# EAGLE design Apex_CV_Expander_MAIN_1.0 (EAGLE 9.5.2)
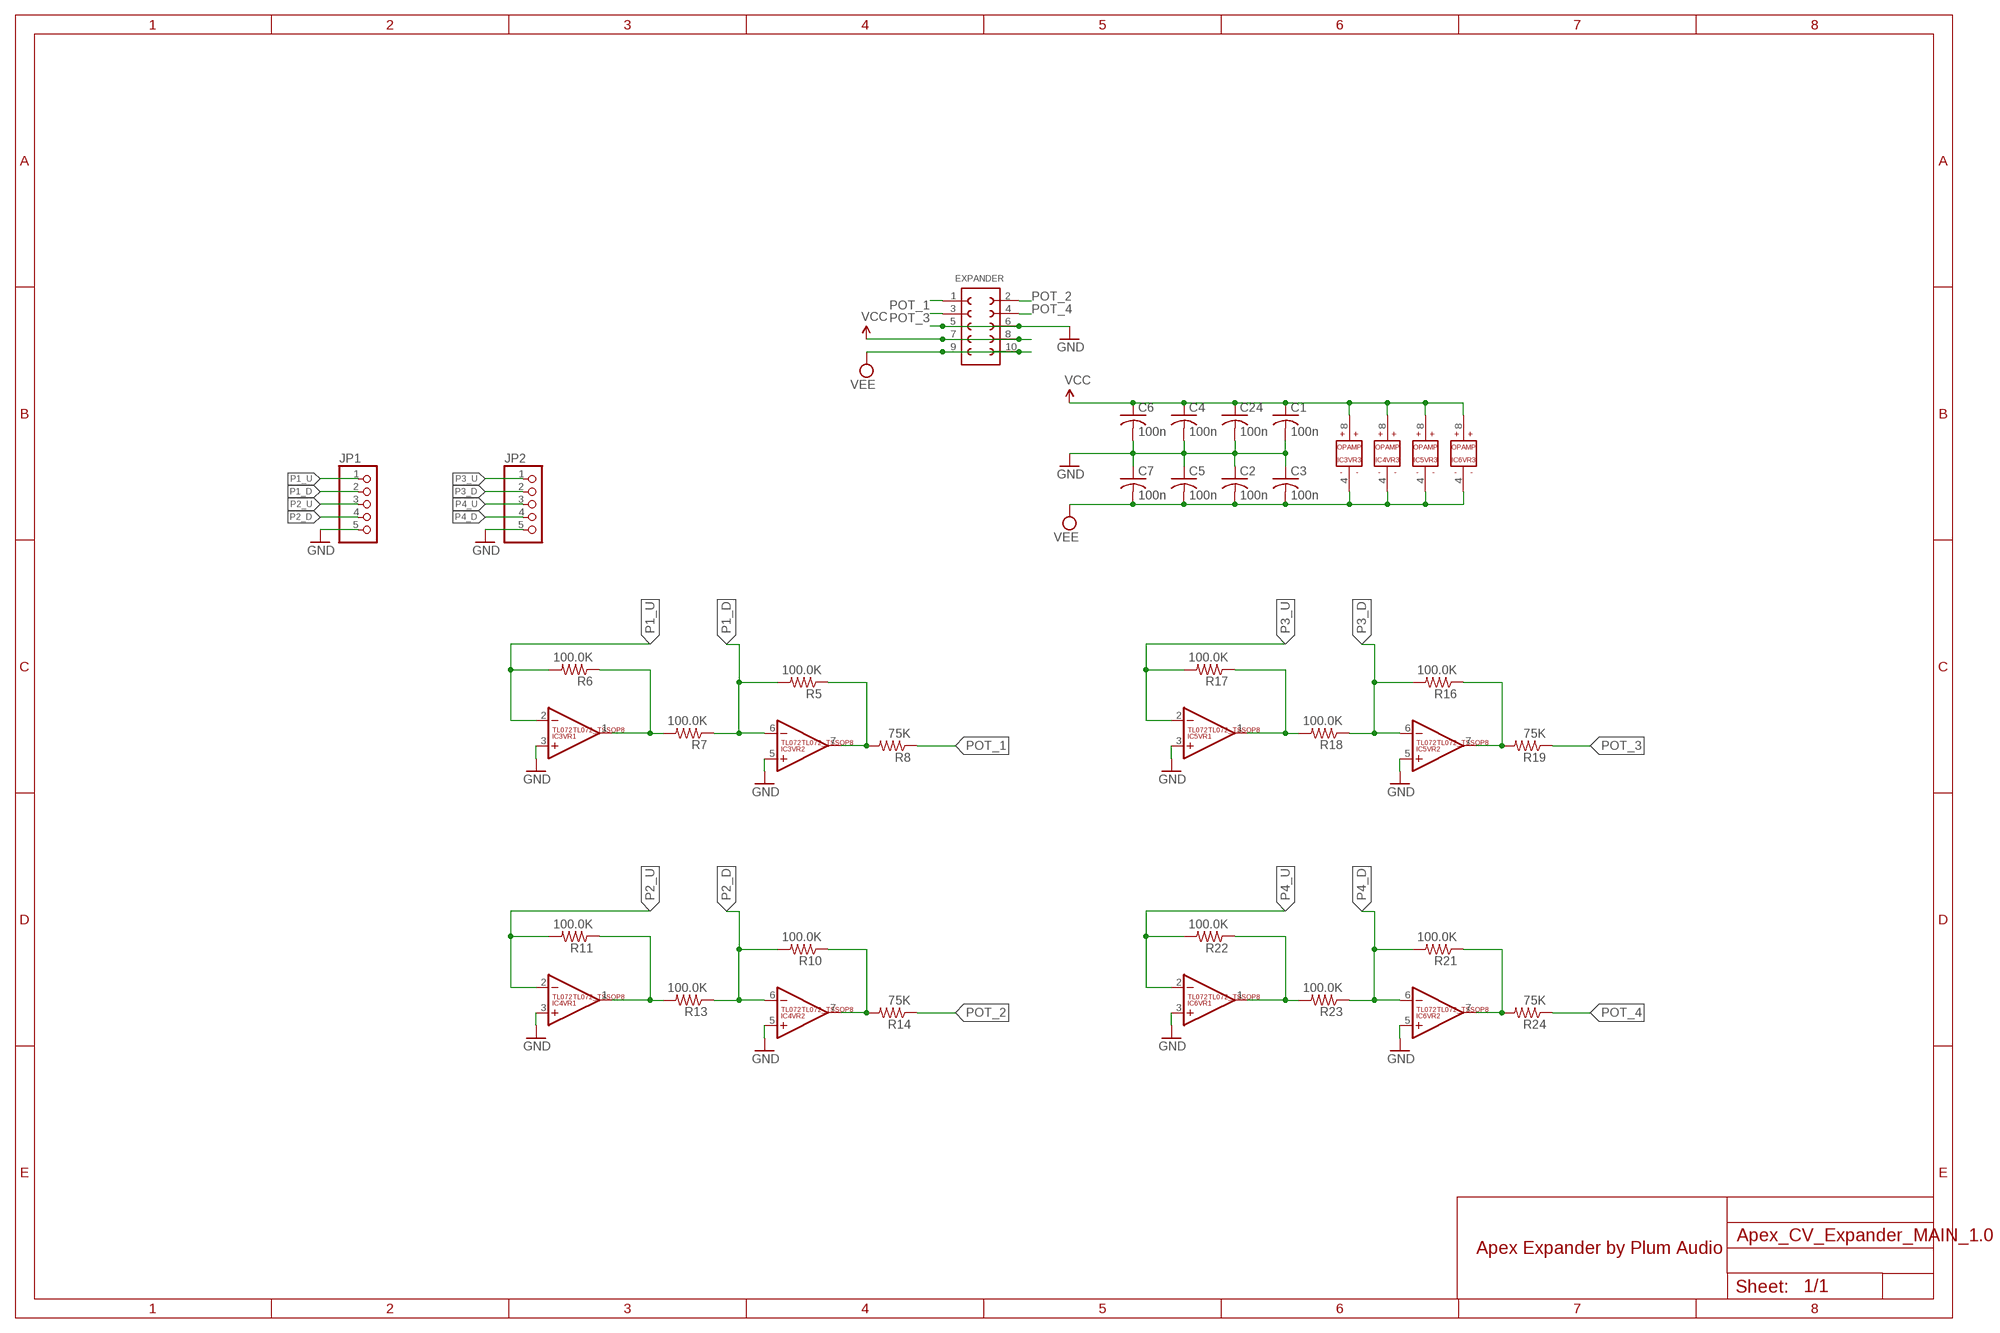
[diagram p0: schematic, sheet 1]

## Parts
C1  100n  C-USC0603  [C0603]
C2  100n  C-USC0603  [C0603]
C3  100n  C-USC0603  [C0603]
C4  100n  C-USC0603  [C0603]
C5  100n  C-USC0603  [C0603]
C6  100n  C-USC0603  [C0603]
C7  100n  C-USC0603  [C0603]
C24  100n  C-USC0603  [C0603]
EXPANDER  61301021121  [61301021121]
IC3  TL072TL072_TSSOP8  [TL072_TSSOP8]
IC4  TL072TL072_TSSOP8  [TL072_TSSOP8]
IC5  TL072TL072_TSSOP8  [TL072_TSSOP8]
IC6  TL072TL072_TSSOP8  [TL072_TSSOP8]
JP1  PINHD-1X5  [1X05]
JP2  PINHD-1X5  [1X05]
R5  100.0K  R-US_R0603  [R0603]
R6  100.0K  R-US_R0603  [R0603]
R7  100.0K  R-US_R0603  [R0603]
R8  75K  R-US_R0603  [R0603]
R10  100.0K  R-US_R0603  [R0603]
R11  100.0K  R-US_R0603  [R0603]
R13  100.0K  R-US_R0603  [R0603]
R14  75K  R-US_R0603  [R0603]
R16  100.0K  R-US_R0603  [R0603]
R17  100.0K  R-US_R0603  [R0603]
R18  100.0K  R-US_R0603  [R0603]
R19  75K  R-US_R0603  [R0603]
R21  100.0K  R-US_R0603  [R0603]
R22  100.0K  R-US_R0603  [R0603]
R23  100.0K  R-US_R0603  [R0603]
R24  75K  R-US_R0603  [R0603]

## Nets
GND: C1.2 C2.1 C3.1 C4.2 C5.1 C6.2 C7.1 C24.2 EXPANDER.5 EXPANDER.6 IC3.3(VR1:+IN) IC3.5(VR2:+IN) IC4.3(VR1:+IN) IC4.5(VR2:+IN) IC5.3(VR1:+IN) IC5.5(VR2:+IN) IC6.3(VR1:+IN) IC6.5(VR2:+IN) JP1.5 JP2.5
N$4: IC3.7(VR2:OUT) R5.1 R8.2
N$6: IC3.1(VR1:OUT) R6.1 R7.2
N$10: IC4.7(VR2:OUT) R10.1 R14.2
N$12: IC4.1(VR1:OUT) R11.1 R13.2
N$16: IC5.7(VR2:OUT) R16.1 R19.2
N$18: IC5.1(VR1:OUT) R17.1 R18.2
N$22: IC6.7(VR2:OUT) R21.1 R24.2
N$24: IC6.1(VR1:OUT) R22.1 R23.2
P1_D: IC3.6(VR2:-IN) JP1.2 R5.2 R7.1
P1_U: IC3.2(VR1:-IN) JP1.1 R6.2
P2_D: IC4.6(VR2:-IN) JP1.4 R10.2 R13.1
P2_U: IC4.2(VR1:-IN) JP1.3 R11.2
P3_D: IC5.6(VR2:-IN) JP2.2 R16.2 R18.1
P3_U: IC5.2(VR1:-IN) JP2.1 R17.2
P4_D: IC6.6(VR2:-IN) JP2.4 R21.2 R23.1
P4_U: IC6.2(VR1:-IN) JP2.3 R22.2
POT_1: EXPANDER.1 R8.1
POT_2: EXPANDER.2 R14.1
POT_3: EXPANDER.3 R19.1
POT_4: EXPANDER.4 R24.1
VCC: C1.1 C4.1 C6.1 C24.1 EXPANDER.7 EXPANDER.8 IC3.8(VR3:V+) IC4.8(VR3:V+) IC5.8(VR3:V+) IC6.8(VR3:V+)
VEE: C2.2 C3.2 C5.2 C7.2 EXPANDER.9 EXPANDER.10 IC3.4(VR3:V-) IC4.4(VR3:V-) IC5.4(VR3:V-) IC6.4(VR3:V-)

## Notes on the sheet
- Apex Expander by Plum Audio

## Library data of the parts
C1-C7 C24 = rcl:C-US: CAPACITOR, American symbol
EXPANDER = Wurth_Elektronik_Electromechanic_Board_to_Board_Connectors_rev18b:61301021121: WR-PHD 2.54mm Dual Pin Header, 10 Pins =>Code : Con_BTB_PHD_2.54_2_61301021121 <http://katalog.we-online.de/media/images/eican/Con_BTB_PHD_2.54_2_6130xx21121_pf2.jpg> Details see: http://katalog.we-online.de/en/em/613_0xx_211_21 Created 2014-05-29, Karrer Zheng 2014 (C) Würth Elektronik
IC3-IC6 = EurorackModularParts:TL072
JP1 JP2 = pinhead:PINHD-1X5: PIN HEADER
R5-R8 R10 R11 R13 R14 R16-R19 R21-R24 = rcl:R-US_: RESISTOR, American symbol

## Board
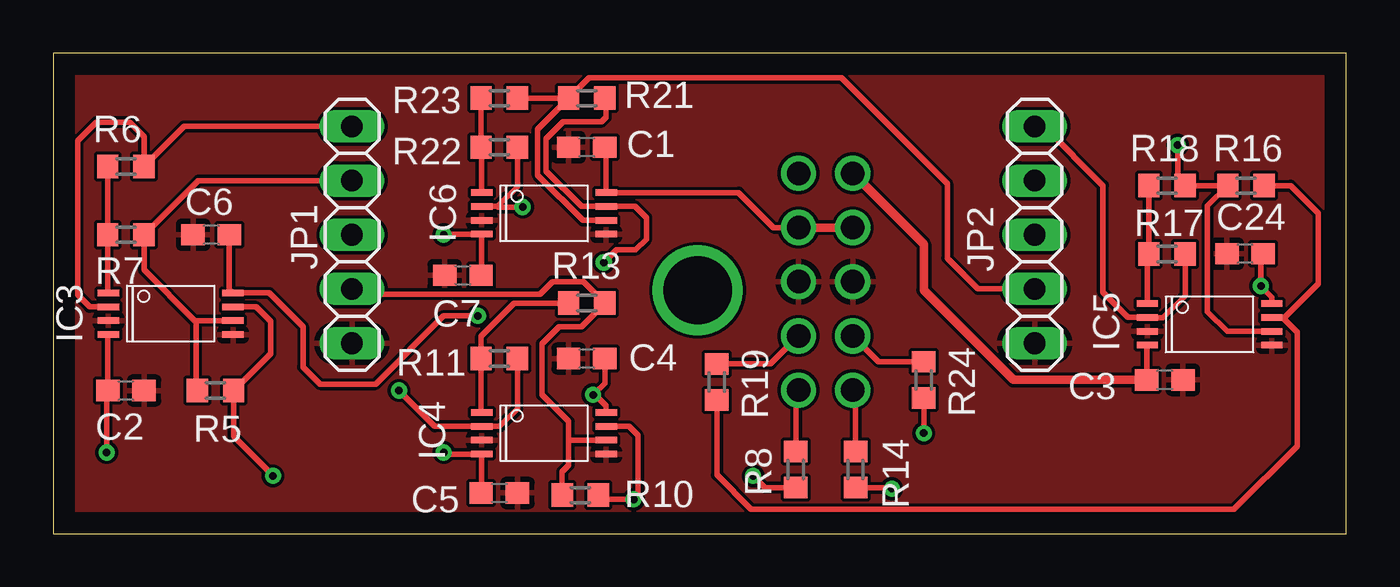
[diagram p1: board, top side]
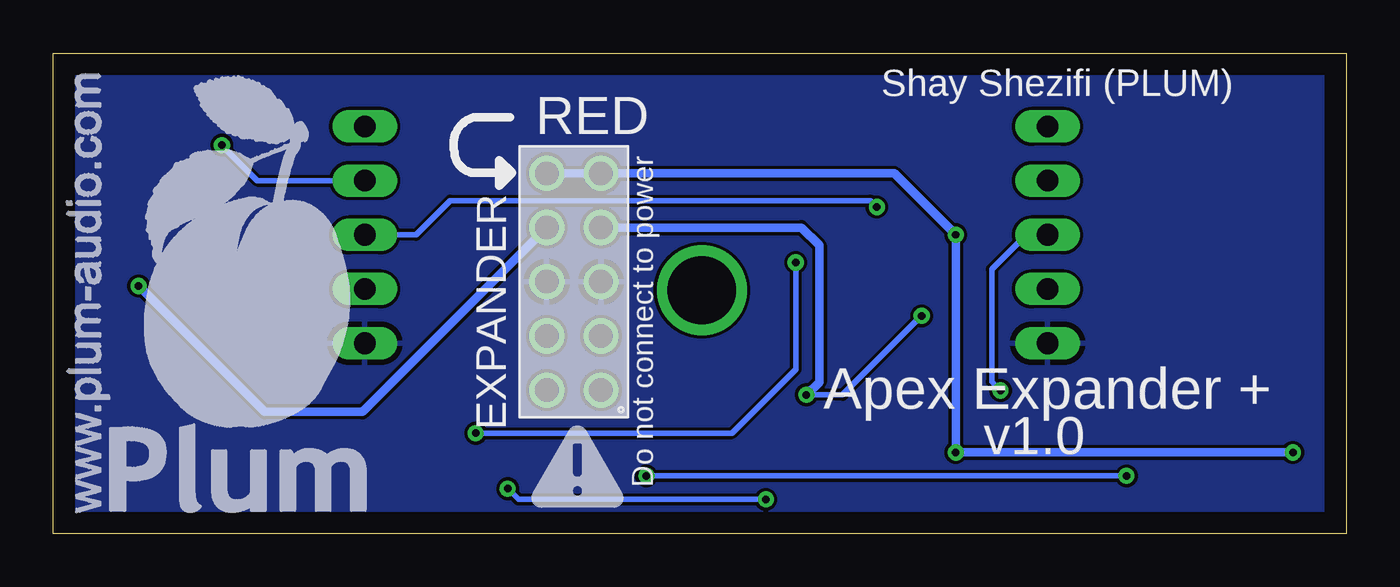
[diagram p2: board, bottom side, seen from below]

Size 60.6 x 22.5 mm. Coordinates in mm from the lower left corner, seen from the top.
Outline: 0,0 60.6,0 60.6,22.5 0,22.5 0,0
Copper layers (1*16): Top 0.035mm / dielectric 1.5mm / Bottom 0.035mm
Design rules "default *": minimum track width 6mil, minimum drill 0.35mm, track to track 6mil, track to pad 6mil, pad to pad 6mil, via to via 6mil, smd to smd 6mil, copper to edge 40mil, drill to drill 6mil, minimum pad ring 10mil, minimum via ring 8mil, stop-mask expansion 4mil, vias tented up to drill 25mil, thermal gap 10mil

### Footprints (pad centres in the part's own frame; a part is rotated, then mirrored left to right if it is on the bottom)
C0603 = smd 1.1 x 1: 1 -0.85,0; 2 0.85,0
61301021121 = drill 1.1: 1 -5.08,-1.27; 2 -5.08,1.27; 3 -2.54,-1.27; 4 -2.54,1.27; 5 0,-1.27; 6 0,1.27; 7 2.54,-1.27; 8 2.54,1.27; 9 5.08,-1.27; 10 5.08,1.27
TL072_TSSOP8 = smd 0.305 x 0.991: 1 -0.975,-2.918; 2 -0.325,-2.918; 3 0.325,-2.918; 4 0.975,-2.918; 5 0.975,2.918; 6 0.325,2.918; 7 -0.325,2.918; 8 -0.975,2.918
1X05 = drill 1.016 long: 1 -5.08,0; 2 -2.54,0; 3 0,0; 4 2.54,0; 5 5.08,0
R0603 = smd 1 x 1.1: 1 -0.85,0; 2 0.85,0

### Placement (x,y rotation side)
C1  25,18.1 180 top
C2  3.4,6.7 180 top
C3  52.1,7.2 180 top
C4  25,8.2 180 top
C5  20.9,1.9 180 top
C6  7.4,14 180 top
C7  19.2,12.1 0 top
C24  55.86,13.11 180 top
EXPANDER  36.2,11.8 90 bottom
IC3  5.5,10.3 270 top
IC4  23,4.7 270 top
IC5  54.2,9.8 270 top
IC6  23,15 270 top
JP1  14,14 270 top
JP2  46,14 270 top
R5  7.6,6.7 180 top
R6  3.4,17.2 0 top
R7  3.4,14 180 top
R8  34.8,3 270 top
R10  24.7,1.8 180 top
R11  20.9,8.2 0 top
R13  25,10.8 180 top
R14  37.6,3 270 top
R16  55.9,16.3 180 top
R17  52.2,13.1 0 top
R18  52.2,16.3 180 top
R19  31.1,7.1 270 top
R21  25,20.4 180 top
R22  20.9,18.1 0 top
R23  20.9,20.4 180 top
R24  40.8,7.2 270 top

### Tracks (layer width: path | path; a pad name or v marks a point on that pad's centre or on a via)
GND
  pour Top: 0,0 0,22.5 2,22.5 60.6,22.5 60.6,22.2 60.6,0 60.2,0
  pour Bottom: 0,0 0,22.5 2,22.5 60.6,22.5 60.6,22.2 60.6,0 60.2,0
N$1  (via drill 3.2)
  other vias: 30.2,11.4
N$4  (via drill 0.35)
  Top 0.254: R8.2 33.35,2.15 v32.8,2.7 | v10.3,2.7 8.45,4.55 R5.1 10.18,8.43 10.18,9.95 9.5,10.62 IC3.7
  Bottom 0.254: v32.8,2.7 v10.3,2.7
N$6
  Top 0.254: IC3.1 2.55,11.31 R7.2 R6.1
N$10  (via drill 0.35)
  Top 0.254: R14.2 39.25,2.15 v39.3,2.1 | R10.1 25.75,1.6 v27.2,1.6 27.4,1.8 27.4,4.6 26.98,5.03 IC4.7
  Bottom 0.254: v39.3,2.1 38.8,1.6 v27.2,1.6
N$12
  Top 0.254: IC4.1 20.05,5.71 R11.1 20.05,9.25 21.6,10.8 R13.2
N$16
  Top 0.254: R16.1 58,16.3 59.3,15 59.3,11.7 57.73,10.12 57.6,10.12 | 57.6,10.12 IC5.7 | R19.2 31.1,2.74 32.7,1.14 55.34,1.14 58.3,4.1 58.3,9.43 57.6,10.12
N$18
  Top 0.254: IC5.1 51.28,13.03 R17.1 R18.2
N$22  (via drill 0.35)
  Top 0.254: R24.2 v40.8,4.7 | v25.8,12.7 26.4,13.3 27.3,13.3 27.8,13.8 27.8,14.8 27.27,15.32 IC6.7 24.75,15.32 23.11,16.97 23.11,18.51 23.9,19.3 25.7,19.3 25.9,19.5 25.9,20.35 R21.1
  Bottom 0.254: v40.8,4.7 28.8,4.7 25.8,7.7 v25.8,12.7
N$24
  Top 0.254: IC6.1 20.08,18.07 R22.1 R23.2
P1_D
  Top 0.254: 7.67,9.97 IC3.6 6.62,9.97 | 7,6.95 R5.2 6.7,6.75 6.7,9.9 6.62,9.97 | 6.62,9.97 4.25,12.35 R7.1 6.79,16.54 JP1.2
P1_U
  Top 0.254: JP1.1 6.13,19.08 R6.2 4.25,18.6 3.57,19.28 2.02,19.28 1.14,18.4 1.14,11.18 1.7,10.62 IC3.2
P2_D
  Top 0.254: R10.2 23.85,2.9 24.15,3.2 24.15,4.4 | 24.15,4.4 24.15,5.25 22.9,6.5 22.9,8.9 23.7,9.7 24.75,9.7 R13.1 24.85,11.8 23.4,11.8 22.81,11.21 14.25,11.21 JP1.4 | IC4.6 24.18,4.38 24.15,4.4
P2_U  (via drill 0.35)
  Top 0.254: R11.2 21.75,5.85 20.93,5.03 IC4.2 17.88,5.03 v16.2,6.7
  Bottom 0.254: v16.2,6.7 16.62,7.12 16.62,12.38 15,14 JP1.3
P3_D  (via drill 0.35)
  Top 0.254: IC5.6 55.02,9.47 54.1,10.4 54.1,15.35 R16.2 R18.1 52.7,16.65 v52.7,18.2
  Bottom 0.254: v52.7,18.2 51.04,16.54 JP2.2
P3_U
  Top 0.254: R17.2 53.05,11.15 52,10.1 51.31,10.1 IC5.2 50.38,10.12 49.2,11.3 49.2,16.3 46.42,19.08 JP2.1
P4_D
  Top 0.254: R23.1 R21.2 | R21.2 22.7,18.95 22.7,16.8 24.82,14.68 IC6.6 | R21.2 25.11,21.36 36.94,21.36 41.9,16.4 41.9,12.9 43.34,11.46 JP2.4
P4_U  (via drill 0.35)
  Top 0.254: IC6.2 20.82,15.32 | R22.2 21.75,16.25 20.82,15.32 | 20.82,15.32 20.85,15.3 v22,15.3
  Bottom 0.254: v22,15.3 22.3,15.6 42,15.6 43.6,14 JP2.3
POT_1
  Top 0.254: EXPANDER.1 34.8,6.59 R8.1
POT_2
  Top 0.254: EXPANDER.2 37.6,6.59 R14.1
POT_3
  Top 0.254: EXPANDER.3 33.62,7.95 R19.1
POT_4
  Top 0.254: EXPANDER.4 38.68,8.05 R24.1
VCC  (via drill 0.35)
  Top 0.254: C1.1 25.92,18.03 IC6.8 32.12,15.97 33.76,14.34 35.1,14.34 | C6.1 8.25,11.44 IC3.8 10.12,11.28 11.7,9.7 11.7,7.8 12.5,7 15.1,7 18.3,10.2 v19.9,10.2 | v25.3,6.5 25.35,6.55 | 25.35,6.55 25.85,7.05 C4.1 | C24.1 56.6,13 v56.6,11.6 57.12,11.08 IC5.8 | IC4.8 25.92,5.98 25.35,6.55
  Top 0.406: EXPANDER.8 35.1,14.34 EXPANDER.7
  Bottom 0.254: v19.9,10.2 23.6,6.5 v25.3,6.5
  Bottom 0.406: EXPANDER.7 25.54,14.34 24.7,13.5 24.7,7.1 v25.3,6.5 | EXPANDER.8 46.11,5.7 50.7,5.7 v56.6,11.6
VEE  (via drill 0.35)
  Top 0.254: v18.3,3.8 18.38,3.73 IC4.4 20.08,1.93 C5.2 | v18.3,14 18.32,14.03 IC6.4 20.08,12.13 C7.2 | C3.2 51.25,8.79 IC5.4 | v2.5,3.8 2.5,6.65 C2.2 2.55,9.29 IC3.4
  Top 0.406: EXPANDER.10 40.8,13.55 40.8,11.4 45,7.2 C3.2
  Bottom 0.406: EXPANDER.10 EXPANDER.9 21.18,16.88 v18.3,14 v18.3,3.8 v2.5,3.8

### Text on the board
bPlace: Shay Shezifi (PLUM) | RED | Do not connect to power | Apex Expander + | v1.0